# Altium schematic sheet CON_BATT_COIN.SchDoc: Lithium Batter Holder - CR2032
size A4; Organization: Altium Limited.; Address1: Level 3, 12a Rodborough Rd; Address2: Frenchs Forest 2086; Address3: NSW; Address4: AUSTRALIA; Revision: 6; SheetNumber: 49; SheetTotal: 64
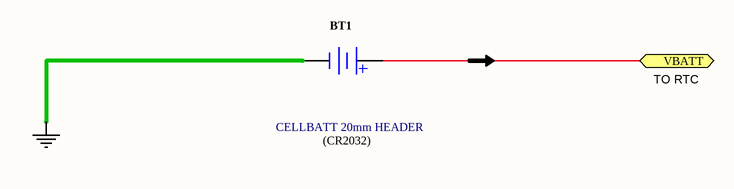
[diagram p0: CON_BATT_COIN.SchDoc]

## Parts
BT1  CELLBATT 20mm HEADER  [CELL_HOLDER]

## Ports
VBATT

## Nets
GND: BT1.2(-)
VBATT: BT1.1(+) ; port VBATT

## Notes on the sheet
- TO RTC
- (CR2032)
- Sheet Title
- Project Title
- Size:
- Date:
- A4
- Assy:
- Time:
- Sheet
- Revision:
- of
- File:

## Library data of the parts
BT1 = D-302-0000: Lithium Battery Holder for CR2032 3V Cell; Category: Battery; Mounting Technology: Through-Hole; Nominal output Voltage: 3 V; Status: Production